# Altium schematic sheet POWER Start.SchDoc
size A3
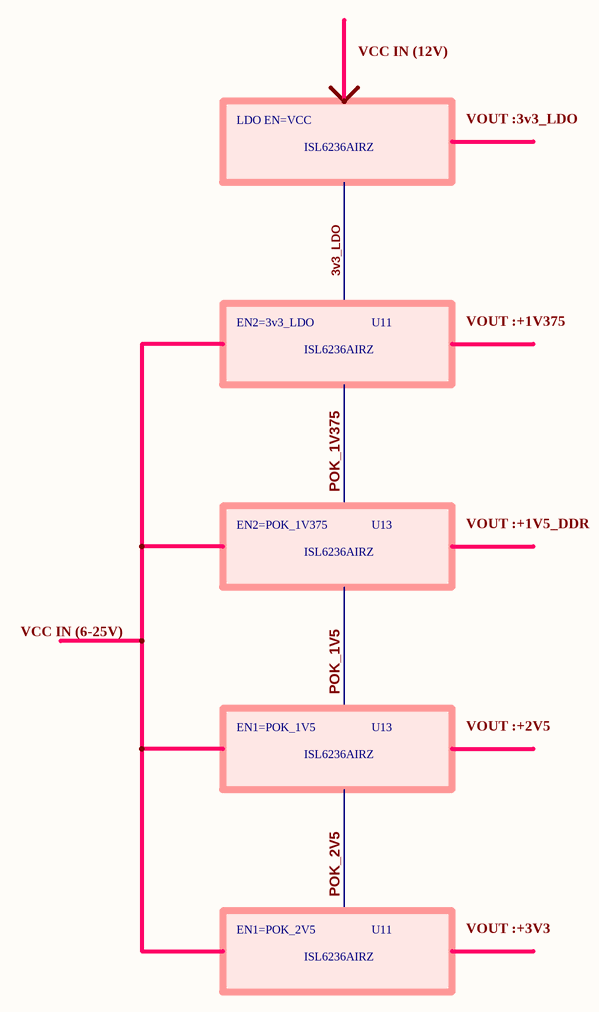
[diagram p0: POWER Start.SchDoc]

## Notes on the sheet
- VCC IN (12V)
- LDO EN=VCC
- VOUT :3v3_LDO
- ISL6236AIRZ
- EN2=3v3_LDO
- U11
- VOUT :+1V375
- EN2=POK_1V375
- U13
- VOUT :+1V5_DDR
- VCC IN (6-25V)
- EN1=POK_1V5
- VOUT :+2V5
- EN1=POK_2V5
- VOUT :+3V3